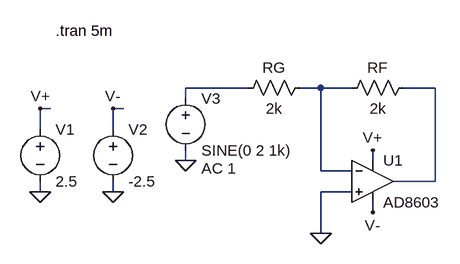
[diagram p0: schematic AD8603.asc]
AD8603.asc, the LTspice schematic file:
Version 4.1
SHEET 1 1668 868
WIRE -48 16 -144 16
WIRE 64 16 32 16
WIRE 112 16 64 16
WIRE 240 16 192 16
WIRE -144 32 -144 16
WIRE -352 48 -368 48
WIRE -240 48 -256 48
WIRE -368 80 -368 48
WIRE -256 80 -256 48
WIRE -144 128 -144 112
WIRE 144 128 144 112
WIRE 64 144 64 16
WIRE 112 144 64 144
WIRE 240 160 240 16
WIRE 240 160 176 160
WIRE -368 176 -368 160
WIRE -256 176 -256 160
WIRE 112 176 64 176
WIRE 144 208 144 192
WIRE 64 240 64 176
FLAG -368 176 0
FLAG -256 176 0
FLAG -256 48 V-
FLAG -368 48 V+
FLAG 144 112 V+
FLAG 144 208 V-
FLAG 64 240 0
FLAG -144 128 0
SYMBOL res 208 0 R90
WINDOW 0 0 56 VBottom 2
WINDOW 3 32 56 VTop 2
SYMATTR InstName RF
SYMATTR Value 2k
SYMBOL res 48 0 R90
WINDOW 0 0 56 VBottom 2
WINDOW 3 32 56 VTop 2
SYMATTR InstName RG
SYMATTR Value 2k
SYMBOL voltage -368 64 R0
WINDOW 123 0 0 Left 0
WINDOW 39 0 0 Left 0
SYMATTR InstName V1
SYMATTR Value 2.5
SYMBOL voltage -256 64 R0
WINDOW 123 0 0 Left 0
WINDOW 39 0 0 Left 0
SYMATTR InstName V2
SYMATTR Value -2.5
SYMBOL voltage -144 16 R0
WINDOW 123 24 124 Left 2
WINDOW 39 0 0 Left 0
SYMATTR Value2 AC 1
SYMATTR InstName V3
SYMATTR Value SINE(0 2 1k)
SYMBOL AD8603 144 96 R0
SYMATTR InstName U1
TEXT -344 -72 Left 2 !.tran 5m

The netlist it stands for:
* AD8603.asc
RF N003 N002 2k
RG N002 N001 2k
V1 V+ 0 2.5
V2 V- 0 -2.5
V3 N001 0 SINE(0 2 1k) AC 1
* U1: AD8603 (symbol AD8603 not available, pins judged from their places): In+=0 In-=N002 V+=V+ V-=V- OUT=N003
.tran 5m
.backanno
.end